# Altium schematic sheet 07 SAI.SchDoc
size 513 x 386 mm
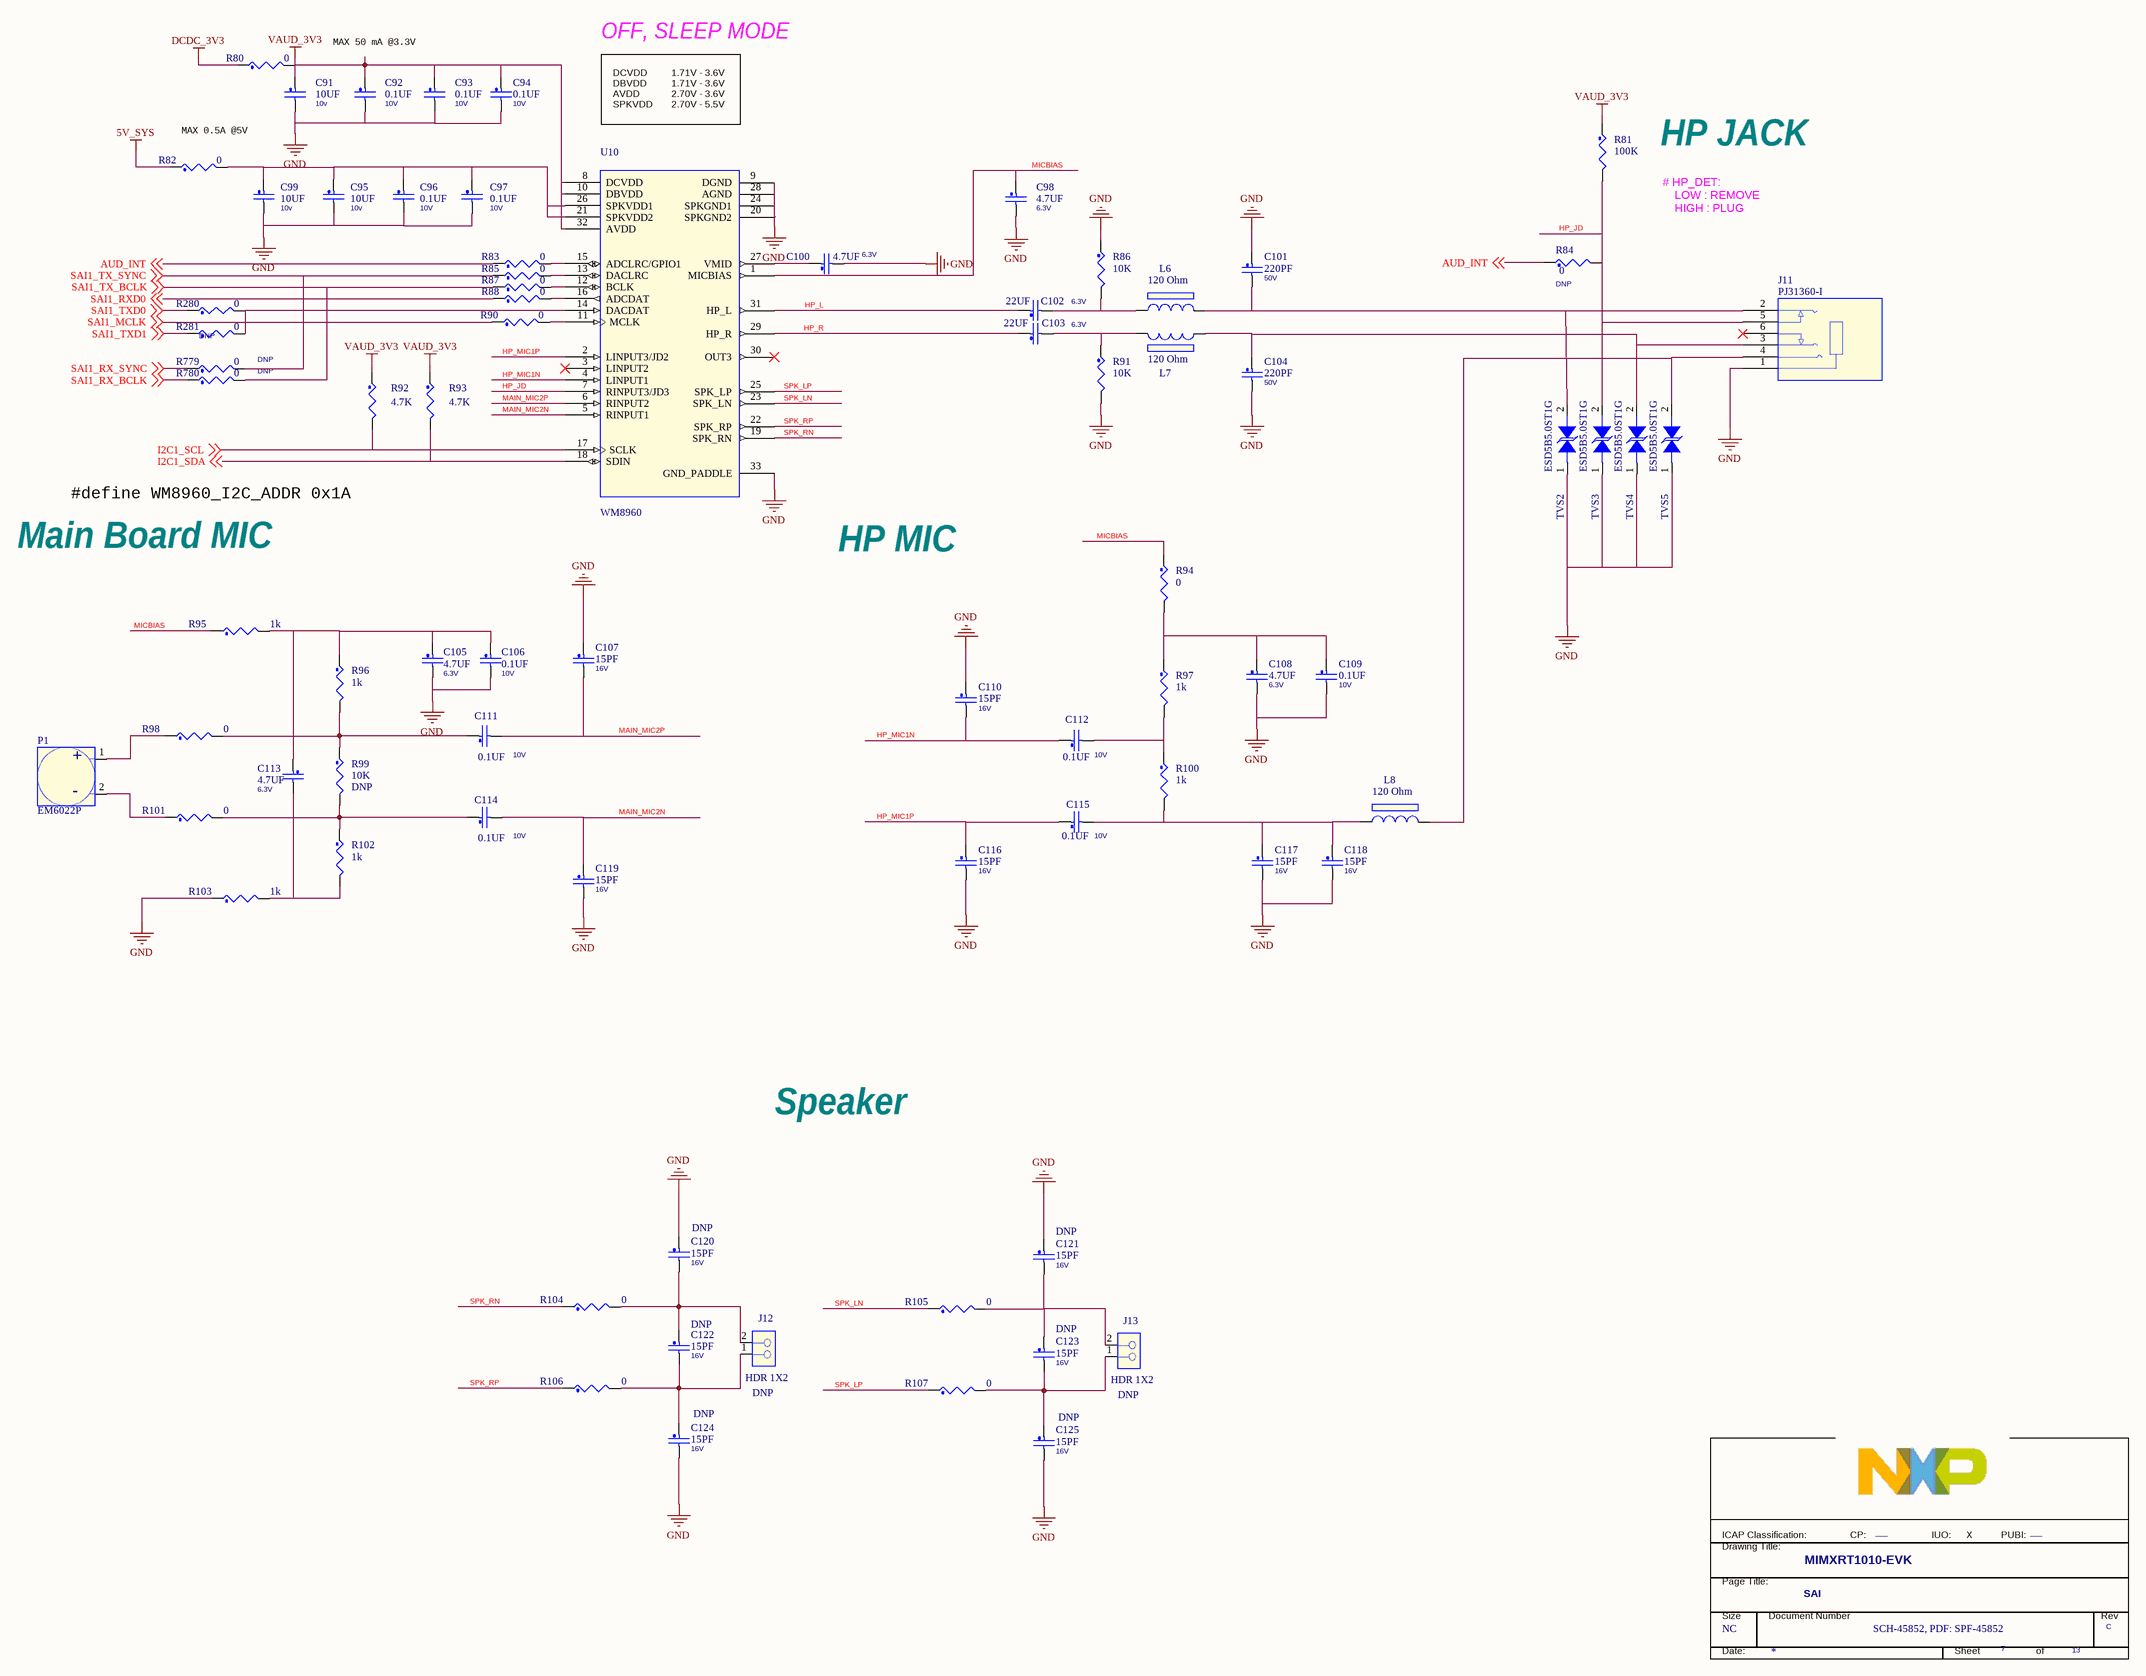
[diagram p0: 07 SAI.SchDoc]

## Parts
*  PUBI: ___  Doc: SCH-45852, PDF: SPF-45852  RevCode: C  Title: MIMXRT1010-EVK  Page Size: NC  Page Number: 7  Page Count: 13  PageTitle: SAI  (hidden comment: TitleBlock_FS)  (graphical)
C91  10UF  VOLTAGE: 10v  [CC0603_OV]
C92  0.1UF  VOLTAGE: 10V  [CC0402_25]
C93  0.1UF  VOLTAGE: 10V  [CC0402_25]
C94  0.1UF  VOLTAGE: 10V  [CC0402_25]
C95  10UF  VOLTAGE: 10v  [CC0603_OV]
C96  0.1UF  VOLTAGE: 10V  [CC0402_25]
C97  0.1UF  VOLTAGE: 10V  [CC0402_25]
C98  4.7UF  VOLTAGE: 6.3V  [0402_CC]
C99  10UF  VOLTAGE: 10v  [CC0603_OV]
C100  4.7UF  VOLTAGE: 6.3V  [0402_CC]
C101  220PF  VOLTAGE: 50V  [0402_CC]
C102  22UF  VOLTAGE: 6.3V  [CC0603_OV]
C103  22UF  VOLTAGE: 6.3V  [CC0603_OV]
C104  220PF  VOLTAGE: 50V  [0402_CC]
C105  4.7UF  VOLTAGE: 6.3V  [0402_CC]
C106  0.1UF  VOLTAGE: 10V  [CC0402_25]
C107  15PF  VOLTAGE: 16V  [0402_CC]
C108  4.7UF  VOLTAGE: 6.3V  [0402_CC]
C109  0.1UF  VOLTAGE: 10V  [CC0402_25]
C110  15PF  VOLTAGE: 16V  [0402_CC]
C111  0.1UF  VOLTAGE: 10V  [CC0402_25]
C112  0.1UF  VOLTAGE: 10V  [CC0402_25]
C113  4.7UF  VOLTAGE: 6.3V  [0402_CC]
C114  0.1UF  VOLTAGE: 10V  [CC0402_25]
C115  0.1UF  VOLTAGE: 10V  [CC0402_25]
C116  15PF  VOLTAGE: 16V  [0402_CC]
C117  15PF  VOLTAGE: 16V  [0402_CC]
C118  15PF  VOLTAGE: 16V  [0402_CC]
C119  15PF  VOLTAGE: 16V  [0402_CC]
C120  15PF  ASSY_OPT: DNP  VOLTAGE: 16V  [0402_CC]
C121  15PF  ASSY_OPT: DNP  VOLTAGE: 16V  [0402_CC]
C122  15PF  ASSY_OPT: DNP  VOLTAGE: 16V  [0402_CC]
C123  15PF  ASSY_OPT: DNP  VOLTAGE: 16V  [0402_CC]
C124  15PF  ASSY_OPT: DNP  VOLTAGE: 16V  [0402_CC]
C125  15PF  ASSY_OPT: DNP  VOLTAGE: 16V  [0402_CC]
J11  PJ31360-I  [con6_audjack_ra_th]
J12  HDR 1X2  ASSY_OPT: DNP  [HDR102]
J13  HDR 1X2  ASSY_OPT: DNP  [HDR102]
L6  120 Ohm  [0402_CC]
L7  120 Ohm  [0402_CC]
L8  120 Ohm  [0402_CC]
P1  EM6022P  [mic_WM-63PR]
R80  0  [0402_CC]
R81  100K  [0402_CC]
R82  0  [0402_CC]
R83  0  [0402_CC]
R84  0  ASSY_OPT: DNP  [0402_CC]
R85  0  [0402_CC]
R86  10K  [0402_CC]
R87  0  [0402_CC]
R88  0  [0402_CC]
R90  0  [0402_CC]
R91  10K  [0402_CC]
R92  4.7K  [RC0402_25]
R93  4.7K  [RC0402_25]
R94  0  [0402_CC]
R95  1k  [0402_CC]
R96  1k  [0402_CC]
R97  1k  [0402_CC]
R98  0  [0402_CC]
R99  10K  ASSY_OPT: DNP  [0402_CC]
R100  1k  [0402_CC]
R101  0  [0402_CC]
R102  1k  [0402_CC]
R103  1k  [0402_CC]
R104  0  [0402_CC]
R105  0  [0402_CC]
R106  0  [0402_CC]
R107  0  [0402_CC]
R280  0  [0402_CC]
R281  0  ASSY_OPT: DNP  [0402_CC]
R779  0  ASSY_OPT: DNP  [0402_CC]
R780  0  ASSY_OPT: DNP  [0402_CC]
TVS2  ESD5B5.0ST1G  [diode2_sod523]
TVS3  ESD5B5.0ST1G  [diode2_sod523]
TVS4  ESD5B5.0ST1G  [diode2_sod523]
TVS5  ESD5B5.0ST1G  [diode2_sod523]
U10  WM8960  [qfn32_s142ep]

## Nets
5V_SYS: R82.1
DCDC_3V3: R80.1
GND: C91.2 C92.2 C93.2 C94.2 C95.2 C96.2 C97.2 C98.2 C99.2 C100.2 C101.1 C104.2 C105.2 C106.2 C107.1 C108.2 C109.2 C110.1 C116.2 C117.2 C118.2 C119.2 C120.1 C121.1 C124.2 C125.2 J11.1 R86.1 R91.2 R103.1 TVS2.1(A1) TVS3.1(A1) TVS4.1(A1) TVS5.1(A1) U10.9(DGND) U10.20(SPKGND2) U10.24(SPKGND1) U10.28(AGND) U10.33(GND_PADDLE)
VAUD_3V3: C91.1 C92.1 C93.1 C94.1 R80.2 R81.1 R92.1 R93.1 U10.8(DCVDD) U10.10(DBVDD) U10.32(AVDD)
AUD_INT: R83.1 R84.1 ; off-sheet AUD_INT
HP_JD: J11.5 R81.2 R84.2 TVS3.2(A2) U10.7(RINPUT3/JD3)
HP_L: C102.1 U10.31(HP_L)
HP_MIC1N: C110.2 C112.1 U10.4(LINPUT1)
HP_MIC1P: C115.1 C116.1 U10.2(LINPUT3/JD2)
HP_R: C103.1 U10.29(HP_R)
I2C1_SCL: R92.2 U10.17(SCLK) ; off-sheet I2C1_SCL
I2C1_SDA: R93.2 U10.18(SDIN) ; off-sheet I2C1_SDA
MAIN_MIC2N: C114.2 C119.1 U10.5(RINPUT1)
MAIN_MIC2P: C107.2 C111.2 U10.6(RINPUT2)
MICBIAS: C98.1 R94.1 R95.1 U10.1(MICBIAS)
SAI1_MCLK: R90.1 ; off-sheet SAI1_MCLK
SAI1_RX_BCLK: R780.1 ; off-sheet SAI1_RX_BCLK
SAI1_RX_SYNC: R779.1 ; off-sheet SAI1_RX_SYNC
SAI1_RXD0: R88.1 ; off-sheet SAI1_RXD0
SAI1_TX_BCLK: R87.1 R780.2 ; off-sheet SAI1_TX_BCLK
SAI1_TX_SYNC: R85.1 R779.2 ; off-sheet SAI1_TX_SYNC
SAI1_TXD0: R280.1 ; off-sheet SAI1_TXD0
SAI1_TXD1: R281.1 ; off-sheet SAI1_TXD1
SPK_LN: R105.1 U10.23(SPK_LN)
SPK_LP: R107.1 U10.25(SPK_LP)
SPK_RN: R104.1 U10.19(SPK_RN)
SPK_RP: R106.1 U10.22(SPK_RP)
NetC95_1: C95.1 C96.1 C97.1 C99.1 R82.2 U10.21(SPKVDD2) U10.26(SPKVDD1)
NetC100_1: C100.1 U10.27(VMID)
NetC101_2: C101.2 J11.2 L6.2 TVS2.2(A2)
NetC102_2: C102.2 L6.1 R86.2
NetC103_2: C103.2 L7.1 R91.1
NetC104_1: C104.1 J11.3 L7.2 TVS4.2(A2)
NetC105_1: C105.1 C106.1 C113.1 R95.2 R96.1
NetC108_1: C108.1 C109.1 R94.2 R97.1
NetC111_1: C111.1 R96.2 R98.2 R99.1
NetC112_2: C112.2 R97.2 R100.1
NetC113_2: C113.2 R102.2 R103.2
NetC114_1: C114.1 R99.2 R101.2 R102.1
NetC115_2: C115.2 C117.1 C118.1 L8.1 R100.2
NetC120_2: C120.2 C122.1 J12.2 R104.2
NetC121_2: C121.2 C123.1 J13.2 R105.2
NetC122_2: C122.2 C124.1 J12.1 R106.2
NetC123_2: C123.2 C125.1 J13.1 R107.2
NetJ11_4: J11.4 L8.2 TVS5.2(A2)
NetP1_1: P1.1(Out) R98.1
NetP1_2: P1.2(GND) R101.1
NetR83_2: R83.2 U10.15(ADCLRC/GPIO1)
NetR85_2: R85.2 U10.13(DACLRC)
NetR87_2: R87.2 U10.12(BCLK)
NetR88_2: R88.2 U10.16(ADCDAT)
NetR90_2: R90.2 U10.11(MCLK)
NetR280_2: R280.2 R281.2 U10.14(DACDAT)

Not connected (* = marked no-connect by the designer): J11 6*; U10 3(LINPUT2)* 30(OUT3)*

## Notes on the sheet
- MAX 50 mA @3.3V
- OFF, SLEEP MODE
- DCVDD
  DBVDD
  AVDD
  SPKVDD
- 1.71V - 3.6V
  1.71V - 3.6V
  2.70V - 3.6V
  2.70V - 5.5V
- (near R82) MAX 0.5A @5V
- HP JACK
- # HP_DET:
  LOW : REMOVE
  HIGH : PLUG
- #define WM8960_I2C_ADDR 0x1A
- Main Board MIC
- HP MIC
- Speaker
- X
- (in symbol MIC_POM) +; -
- (in symbol TitleBlock_FS) ICAP Classification:; CP:; IUO:; PUBI:; Drawing Title:; Page Title:; Size; Document Number; Rev; Date:; Sheet; of

## Library data of the parts
* = TitleBlock_FS: FIUO: _X_; OrgName: Freescale Semiconductor; OrgAddr1: 6501 William Cannon Drive West; OrgAddr2: Austin, TX 78735-8598; FCP: ___; Page Create Date: March  8, 1995; Page Modify Date: *
C91 = CAP_NP: CAP CER 10UF 10V 10% X5R 0603; CLASS: DISCRETE; FPLIST: CC0603_OV,CC0603,0603_CC; CAD_APPROVED: Yes; Temp_Range: -55¡ãC ~ 85¡ãC; MFG_PN01: GRM188R61A106KE69D; MFG_NAME01: MURATA; AGILE_PN: 150-78675; HEIGHT: 1.016MM; ROHS: Yes; Tolerance: 10%; PCB Footprint: CC0603_OV
C92 C93 C96 C97 C109 C112 C114 = CAP_NP: CAP CER 0.1UF 10V 10% X5R 0402; CLASS: DISCRETE; AGILE_PN: 150-75634; MFG_NAME01: YAGEO AMERICA; MFG_PN01: CC0402KRX5R6BB104; CAD_APPROVED: Yes; FPLIST: CC0402_25,CC0402_HD,0402_CC; Tolerance: 10%; ROHS: Yes; HEIGHT: 0.64MM; PCB Footprint: CC0402_25
C94 C106 C111 C115 = CAP_NP: CAP CER 0.1UF 10V 10% X5R 0402; CLASS: DISCRETE; FPLIST: CC0402_25,CC0402_HD,0402_CC; CAD_APPROVED: Yes; MFG_PN01: CC0402KRX5R6BB104; MFG_NAME01: YAGEO AMERICA; AGILE_PN: 150-75634; HEIGHT: 0.64MM; ROHS: Yes; Tolerance: 10%; PCB Footprint: CC0402_25
C95 C99 = CAP_NP: CAP CER 10UF 10V 10% X5R 0603; CLASS: DISCRETE; AGILE_PN: 150-78675; MFG_NAME01: MURATA; MFG_PN01: GRM188R61A106KE69D; Temp_Range: -55¡ãC ~ 85¡ãC; CAD_APPROVED: Yes; FPLIST: CC0603_OV,CC0603,0603_CC; Tolerance: 10%; ROHS: Yes; HEIGHT: 1.016MM; PCB Footprint: CC0603_OV
C98 C100 C105 C113 = CAP_NP: CAP CER 4.7UF 6.3V 20% X5R 0402; CLASS: DISCRETE; FPLIST: CC0402_25,CC0402_HD,0402_CC; CAD_APPROVED: Yes; MFG_PN01: C1005X5R0J475M050BC; MFG_NAME01: TDK; AGILE_PN: 150-78463; HEIGHT: 0.65MM; ROHS: Yes; Tolerance: 20%; voltage rating: 6.3V; PCB Footprint: 0402_CC
C101 C104 = CAP_NP: CAP CER 220PF 50V 5% C0G 0402; CLASS: DISCRETE; FPLIST: CC0402_25,CC0402_HD,0402_CC; CAD_APPROVED: Yes; MFG_PN01: C0402C221J5GAC; MFG_NAME01: KEMET; AGILE_PN: 150-30297; HEIGHT: 0.55MM; ROHS: Yes; Tolerance: 5%; PCB Footprint: 0402_CC
C102 C103 = CAP_NP: CAP CER 22UF 6.3V 20% X5R 0603; CLASS: DISCRETE; FPLIST: CC0603_OV,CC0603,0603_CC; CAD_APPROVED: Yes; MFG_PN01: CL10A226MQ8NRNE; MFG_NAME01: Samsung; AGILE_PN: 150-78467; HEIGHT: 1MM; ROHS: Yes; Tolerance: 20%; PCB Footprint: CC0603_OV
C107 C117-C119 C124 C125 = CAP_NP: CAP CER 15PF 16V 5% C0G 0402; CLASS: DISCRETE; AGILE_PN: 150-75720; MFG_NAME01: KEMET; MFG_PN01: C0402C150J4GAC; CAD_APPROVED: Yes; FPLIST: CC0402_25,CC0402_HD,0402_CC; Tolerance: 5%; ROHS: Yes; HEIGHT: 0.55MM; PCB Footprint: 0402_CC
C108 = CAP_NP: CAP CER 4.7UF 6.3V 20% X5R 0402; CLASS: DISCRETE; AGILE_PN: 150-78463; MFG_NAME01: TDK; MFG_PN01: C1005X5R0J475M050BC; CAD_APPROVED: Yes; FPLIST: CC0402_25,CC0402_HD,0402_CC; voltage rating: 6.3V; Tolerance: 20%; ROHS: Yes; HEIGHT: 0.65MM; PCB Footprint: 0402_CC
C110 C116 C120-C123 = CAP_NP: CAP CER 15PF 16V 5% C0G 0402; CLASS: DISCRETE; FPLIST: CC0402_25,CC0402_HD,0402_CC; CAD_APPROVED: Yes; MFG_PN01: C0402C150J4GAC; MFG_NAME01: KEMET; AGILE_PN: 150-75720; HEIGHT: 0.55MM; ROHS: Yes; Tolerance: 5%; PCB Footprint: 0402_CC
J11 = CONN_AUDIOJACK_6P: CON 6 AUD JACK RA SMT -- 191H AU; CLASS: IO; CAD_APPROVED: Yes; MFG_NAME01: SHENZHEN ATOM TECHNOLOGY CO.,LTD; AGILE_PN: 211-79704; PCB Footprint: con6_audjack_ra_th; HEIGHT: 4.85 MM; ROHS: Yes; MFG_PN01: PJ31360-I
J12 J13 = CONN_HDR_2X1: HDR 1X2 TH 100MIL SP 339H AU 98L; CLASS: IO; CAD_APPROVED: Yes; Temp_Range: -55¡ãC to +105¡ãC; MFG_PN01: 0901S0202011N9T-31RF; MFG_NAME01: ANYTRONIC CORPORATION LIMITED; AGILE_PN: 210-81490; PCB Footprint: HDR102; HEIGHT: 8.59MM; ROHS: Yes
L6 L8 = INDUCTOR_FERRITE: IND FER BEAD 120 OHM@100MHZ 0.5A 25% 0402; PART_TYPE: FERRITE\BEAD; CLASS: DISCRETE; AGILE_PN: 180-77771; MFG_NAME01: Murata; MFG_PN01: BLM15AG121SN1D; CAD_APPROVED: Yes; FPLIST: IND_0402,0402_CC; Tolerance: 25%; ROHS: Yes; HEIGHT: 0.55MM; PCB Footprint: 0402_CC
L7 = INDUCTOR_FERRITE: IND FER BEAD 120 OHM@100MHZ 0.5A 25% 0402; PART_TYPE: FERRITE\BEAD; CLASS: DISCRETE; FPLIST: IND_0402,0402_CC; CAD_APPROVED: Yes; MFG_PN01: BLM15AG121SN1D; MFG_NAME01: Murata; AGILE_PN: 180-77771; HEIGHT: 0.55MM; ROHS: Yes; Tolerance: 25%; PCB Footprint: 0402_CC
P1 = MIC_POM: AUDIO DEVICE MIC 0.5MA 2V 38-48+/-3dB 2.2KOHM 6MM TH; CLASS: IC; AGILE_PN: 510-77987; MFG_NAME01: Soberton Inc; CAD_APPROVED: Yes; PCB Footprint: mic_WM-63PR; MFG_PN01: EM6022P; ROHS: Yes; HEIGHT: 2.4MM
R80 R83 R85 R88 R90 R104 R107 R779 = RES_Dup1: RES MF ZERO OHM 1/16W 5% 0402; CLASS: DISCRETE; AGILE_PN: 470-75394; MFG_NAME01: ROHM; MFG_PN01: MCR01MZPJ000; CAD_APPROVED: Yes; FPLIST: RC0402_25,RC0402_HD,RC0402_X2,0402_CC; PCB Footprint: 0402_CC; HEIGHT: 0.45 MM; Tolerance: 5%; ROHS: Yes
R81 = RES_Dup1: RES MF 100K 1/16W 5% 0402; CLASS: DISCRETE; Temp_Range: -55C to +155C; FPLIST: RC0402_25,RC0402_HD,0402_CC; CAD_APPROVED: Yes; MFG_PN01: CR0402-16W-104JT; MFG_NAME01: VENKEL COMPANY; AGILE_PN: 470-75597; PCB Footprint: 0402_CC; HEIGHT: 0.40 MM; ROHS: Yes; Tolerance: 5%
R82 R84 R87 R94 R98 R101 R105 R106 R280 R281 R780 = RES_Dup1: RES MF ZERO OHM 1/16W 5% 0402; CLASS: DISCRETE; FPLIST: RC0402_25,RC0402_HD,RC0402_X2,0402_CC; CAD_APPROVED: Yes; MFG_PN01: MCR01MZPJ000; MFG_NAME01: ROHM; AGILE_PN: 470-75394; PCB Footprint: 0402_CC; ROHS: Yes; Tolerance: 5%; HEIGHT: 0.45 MM
R86 = RES_Dup1: RES MF 10K 1/16W 5% 0402; CLASS: DISCRETE; FPLIST: RC0402_25,RC0402_HD,0402_CC; CAD_APPROVED: Yes; MFG_PN01: CRCW040210K0JNED; MFG_NAME01: VISHAY INTERTECHNOLOGY; AGILE_PN: 470-75557; PCB Footprint: 0402_CC; HEIGHT: 0.4 MM; ROHS: Yes; Tolerance: 5%
R91 R99 = RES_Dup1: RES MF 10K 1/16W 5% 0402; CLASS: DISCRETE; AGILE_PN: 470-75557; MFG_NAME01: VISHAY INTERTECHNOLOGY; MFG_PN01: CRCW040210K0JNED; CAD_APPROVED: Yes; FPLIST: RC0402_25,RC0402_HD,0402_CC; PCB Footprint: 0402_CC; HEIGHT: 0.4 MM; Tolerance: 5%; ROHS: Yes
  R99: TOL: 5%
R92 = RES_Dup1: RES MF 4.7K 1/16W 5% 0402; CLASS: DISCRETE; FPLIST: RC0402_25,RC0402_HD,0402_CC; CAD_APPROVED: Yes; MFG_PN01: NRCL04J472TRF; MFG_NAME01: NIC COMPONENTS CORP; AGILE_PN: 470-75626; PCB Footprint: RC0402_25; HEIGHT: 0.41mm; ROHS: Yes; Tolerance: 5%
R93 = RES_Dup1: RES MF 4.7K 1/16W 5% 0402; CLASS: DISCRETE; AGILE_PN: 470-75626; MFG_NAME01: NIC COMPONENTS CORP; MFG_PN01: NRCL04J472TRF; CAD_APPROVED: Yes; FPLIST: RC0402_25,RC0402_HD,0402_CC; PCB Footprint: RC0402_25; Tolerance: 5%; ROHS: Yes; HEIGHT: 0.41mm
R95 R97 R100 R103 = RES_Dup1: RES MF 1.0K 1/16W 5% 0402; CLASS: DISCRETE; FPLIST: RC0402_25,RC0402_HD,RC0402_X2,0402_CC; CAD_APPROVED: Yes; MFG_PN01: CRCW04021K00JNED; MFG_NAME01: VISHAY INTERTECHNOLOGY; AGILE_PN: 470-75555; PCB Footprint: 0402_CC; HEIGHT: 0.41mm; ROHS: Yes; Tolerance: 5%
R96 R102 = RES_Dup1: RES MF 1.0K 1/16W 5% 0402; CLASS: DISCRETE; AGILE_PN: 470-75555; MFG_NAME01: VISHAY INTERTECHNOLOGY; MFG_PN01: CRCW04021K00JNED; CAD_APPROVED: Yes; FPLIST: RC0402_25,RC0402_HD,RC0402_X2,0402_CC; PCB Footprint: 0402_CC; HEIGHT: 0.41mm; Tolerance: 5%; ROHS: Yes
TVS2-TVS5 = DIODE_TVS_BIDIR: DIODE SUPPRESSOR 16A@30NS 5V@1UA SOD-523; CLASS: IC; AGILE_PN: 480-76937; MFG_NAME01: on semiconductor; CAD_APPROVED: Yes; PCB Footprint: diode2_sod523; MFG_PN01: ESD5B5.0ST1G; ROHS: Yes; HEIGHT: 0.7MM
U10 = WM8960_QFN_33P: IC CODEC STEREO WITH CLASS D SPEAKER DRIVER 1.71-3.6V QFN32; CAD_APPROVED: Yes; MFG_PN01: WM8960CGEFL/RV; MFG_NAME01: WOLFSON MICROELECTRONICS; AGILE_PN: 315-79450; CLASS: IC; PCB Footprint: qfn32_s142ep; HEIGHT: 1MM; ROHS: Yes